# Altium project ResistorChipPackage.PrjPcb
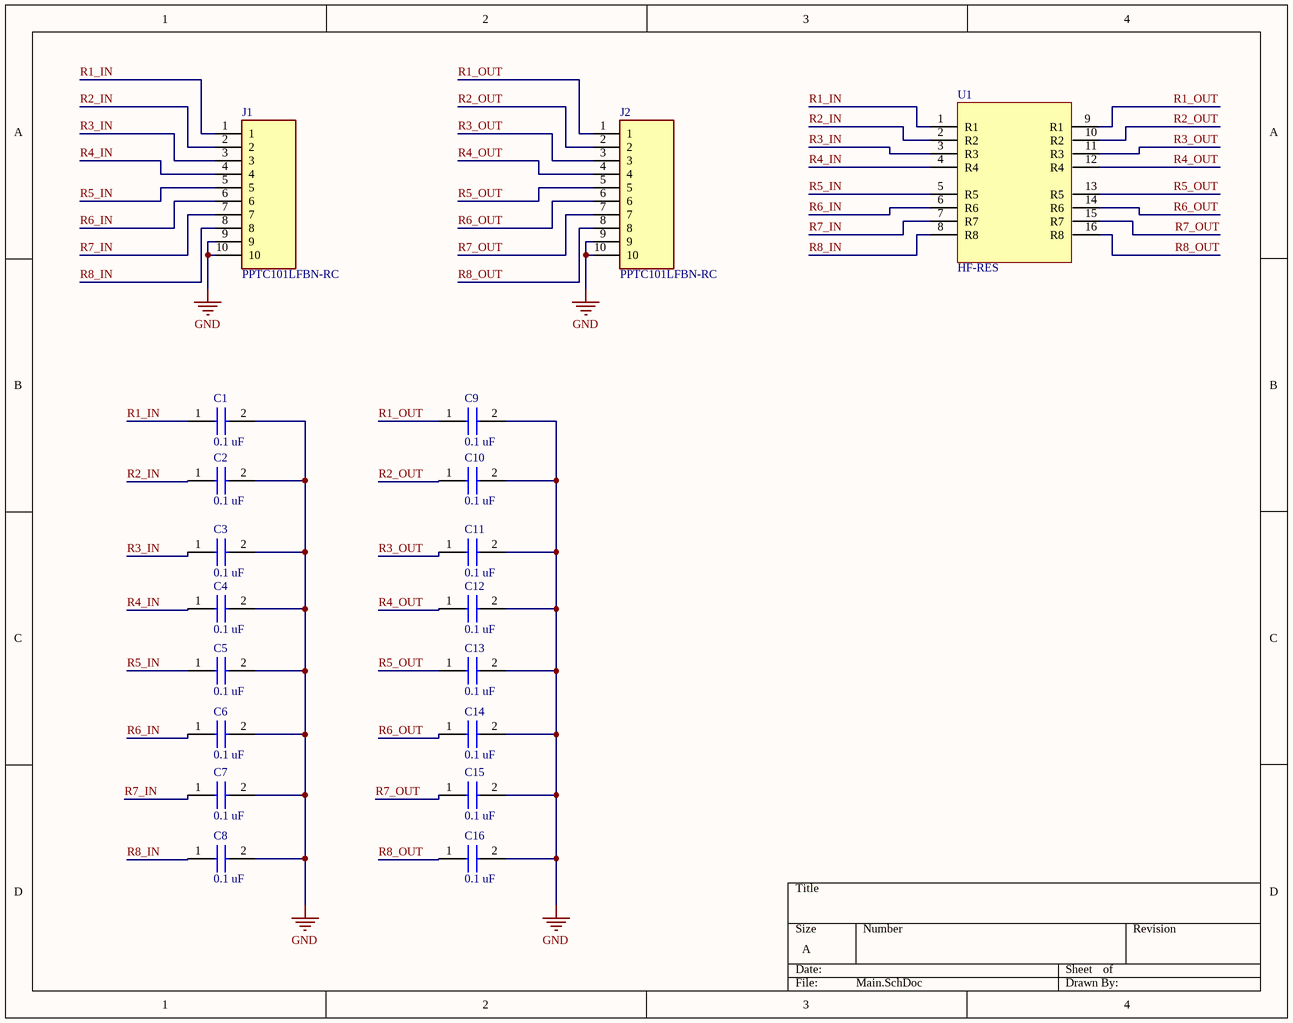
[diagram p0: Main.SchDoc]
1 sheet, 19 parts. Net scope: global (net labels, ports and power ports of the same name join across sheets).
Board file: ResistorChipPackage.PcbDoc

## Sheet Main.SchDoc
size A; SheetNumber: 1; SheetTotal: 1

### Parts
C1  0.1 uF  [C0603]
C2  0.1 uF  [C0603]
C3  0.1 uF  [C0603]
C4  0.1 uF  [C0603]
C5  0.1 uF  [C0603]
C6  0.1 uF  [C0603]
C7  0.1 uF  [C0603]
C8  0.1 uF  [C0603]
C9  0.1 uF  [C0603]
C10  0.1 uF  [C0603]
C11  0.1 uF  [C0603]
C12  0.1 uF  [C0603]
C13  0.1 uF  [C0603]
C14  0.1 uF  [C0603]
C15  0.1 uF  [C0603]
C16  0.1 uF  [C0603]
J1  PPTC101LFBN-RC  [RHDR10W80P0X254_1X10_2590X254X850P]
J2  PPTC101LFBN-RC  [RHDR10W80P0X254_1X10_2590X254X850P]
U1  HF-RES  [HF-COB]

### Nets
GND: C1.2 C2.2 C3.2 C4.2 C5.2 C6.2 C7.2 C8.2 C9.2 C10.2 C11.2 C12.2 C13.2 C14.2 C15.2 C16.2 J1.9 J1.10 J2.9 J2.10
R1_IN: C1.1 J1.1 U1.1(R1)
R1_OUT: C9.1 J2.1 U1.9(R1)
R2_IN: C2.1 J1.2 U1.2(R2)
R2_OUT: C10.1 J2.2 U1.10(R2)
R3_IN: C3.1 J1.3 U1.3(R3)
R3_OUT: C11.1 J2.3 U1.11(R3)
R4_IN: C4.1 J1.4 U1.4(R4)
R4_OUT: C12.1 J2.4 U1.12(R4)
R5_IN: C5.1 J1.5 U1.5(R5)
R5_OUT: C13.1 J2.5 U1.13(R5)
R6_IN: C6.1 J1.6 U1.6(R6)
R6_OUT: C14.1 J2.6 U1.14(R6)
R7_IN: C7.1 J1.7 U1.7(R7)
R7_OUT: C15.1 J2.7 U1.15(R7)
R8_IN: C8.1 J1.8 U1.8(R8)
R8_OUT: C16.1 J2.8 U1.16(R8)

### Library data of the parts
C1-C16 = C0603C104K5RAC7411: Capacitor; Manufacturer_Name: KEMET; Datasheet Link: https://content.kemet.com/datasheets/KEM_C1002_X7R_SMD.pdf; Height: 0.87mm; Manufacturer_Part_Number: C0603C104K5RAC7411; Mouser Part Number: 80-C0603C104K5R7411; Mouser Price/Stock: https://www.mouser.co.uk/ProductDetail/KEMET/C0603C104K5RAC7411?qs=JxH5GSBHSCRTO9iUpWbJFg%3D%3D; Arrow Part Number: C0603C104K5RAC7411; Arrow Price/Stock: https://www.arrow.com/en/products/c0603c104k5rac7411/kemet-corporation?region=nac
J1 J2 = PPTC101LFBN-RC: Connector; Manufacturer_Name: Sullins; Datasheet Link: http://www.sullinscorp.com/drawings/78_P(N)PxCxxxLFBN-RC,_10492-H.pdf; Height: 8.5mm; Manufacturer_Part_Number: PPTC101LFBN-RC
U1 = HF-RES: Resistor chip for packaging test